# EAGLE design LispBadge (EAGLE 7.6.0)
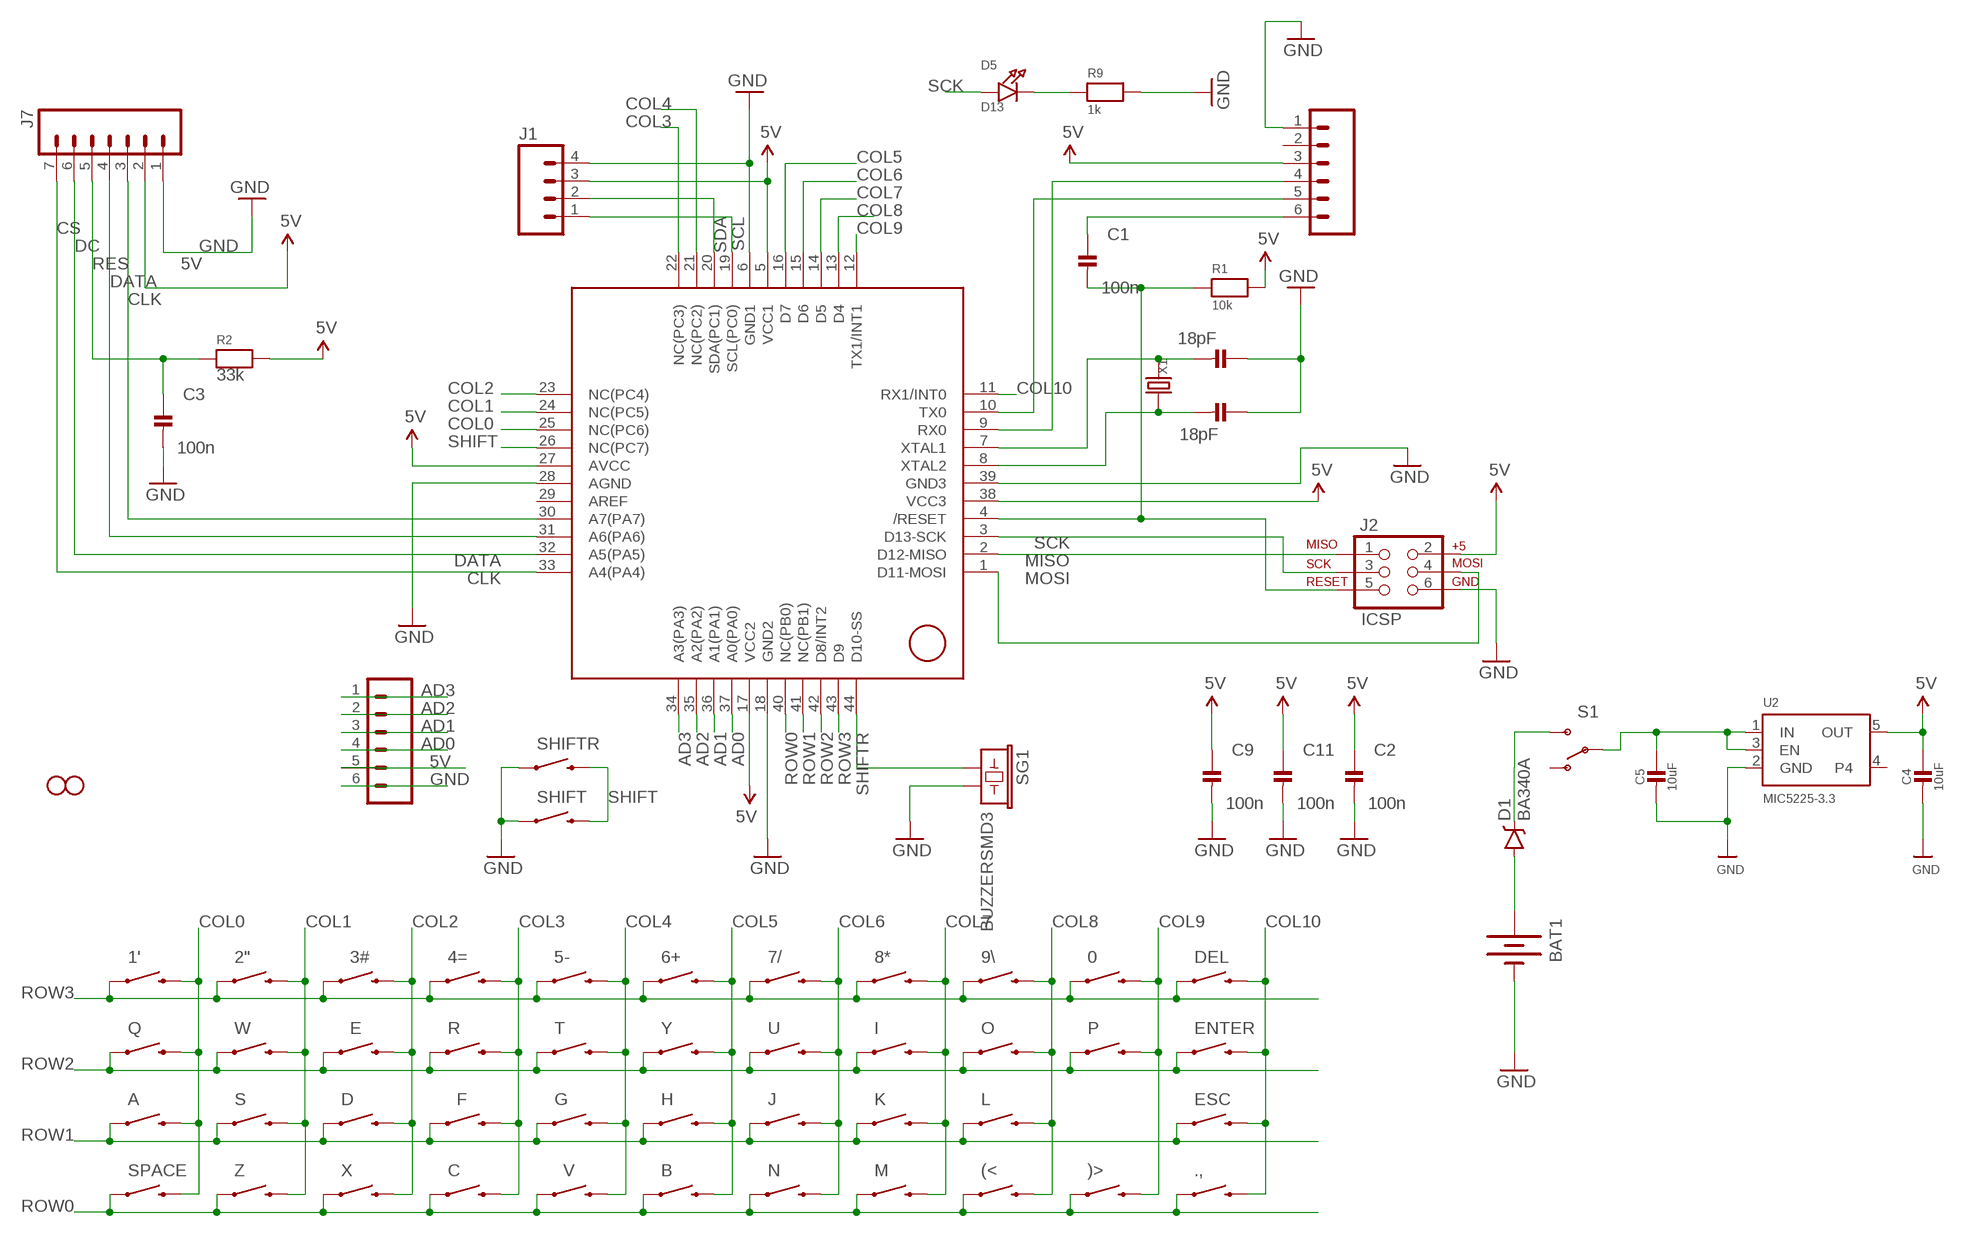
[diagram p0: schematic, sheet 1]

## Parts
0  SWITCH-MOMENTARY-2PTH  [TACTILE-PTH]
1'  SWITCH-MOMENTARY-2PTH  [TACTILE-PTH]
2"  SWITCH-MOMENTARY-2PTH  [TACTILE-PTH]
3#  SWITCH-MOMENTARY-2PTH  [TACTILE-PTH]
4=  SWITCH-MOMENTARY-2PTH  [TACTILE-PTH]
5-  SWITCH-MOMENTARY-2PTH  [TACTILE-PTH]
6+  SWITCH-MOMENTARY-2PTH  [TACTILE-PTH]
7/  SWITCH-MOMENTARY-2PTH  [TACTILE-PTH]
8*  SWITCH-MOMENTARY-2PTH  [TACTILE-PTH]
9\\  SWITCH-MOMENTARY-2PTH  [TACTILE-PTH]
(<  SWITCH-MOMENTARY-2PTH  [TACTILE-PTH]
)>  SWITCH-MOMENTARY-2PTH  [TACTILE-PTH]
.,  SWITCH-MOMENTARY-2PTH  [TACTILE-PTH]
A  SWITCH-MOMENTARY-2PTH  [TACTILE-PTH]
B  SWITCH-MOMENTARY-2PTH  [TACTILE-PTH]
BAT1  BATTERYAAA-KIT  [BATTERY-AAA-KIT]
C  SWITCH-MOMENTARY-2PTH  [TACTILE-PTH]
C1  100n  CAP_CERAMIC_0805MP  [_0805MP]
C2  100n  CAP_CERAMIC_0805MP  [_0805MP]
C3  100n  CAP_CERAMIC_0805MP  [_0805MP]
C4  10uF  CAP_CERAMIC0805-NOOUTLINE  [0805-NO]
C5  10uF  CAP_CERAMIC0805-NOOUTLINE  [0805-NO]
C9  100n  CAP_CERAMIC_0805MP  [_0805MP]
C11  100n  CAP_CERAMIC_0805MP  [_0805MP]
C12  18pF  CAP_CERAMIC_0805MP  [_0805MP]
C13  18pF  CAP_CERAMIC_0805MP  [_0805MP]
D  SWITCH-MOMENTARY-2PTH  [TACTILE-PTH]
D1  BA340A  B340A  [SMA-DIODE]
D5  D13  LED0805_NOOUTLINE  [CHIPLED_0805_NOOUTLINE]
DEL  SWITCH-MOMENTARY-2PTH  [TACTILE-PTH]
E  SWITCH-MOMENTARY-2PTH  [TACTILE-PTH]
ENTER  SWITCH-MOMENTARY-2PTH  [TACTILE-PTH]
ESC  SWITCH-MOMENTARY-2PTH  [TACTILE-PTH]
F  SWITCH-MOMENTARY-2PTH  [TACTILE-PTH]
G  SWITCH-MOMENTARY-2PTH  [TACTILE-PTH]
H  SWITCH-MOMENTARY-2PTH  [TACTILE-PTH]
I  SWITCH-MOMENTARY-2PTH  [TACTILE-PTH]
J  SWITCH-MOMENTARY-2PTH  [TACTILE-PTH]
J1  M04LONGPADS  [1X04_LONGPADS]
J2  ICSP  AVR_SPI_PRG_6PTH  [2X3]
J7  M07  [1X07]
JP1  M06LONGPADS  [1X06_LONGPADS]
JP4  STAND-OFF  [STAND-OFF]
JP5  STAND-OFF  [STAND-OFF]
JP11  M06LONGPADS  [1X06_LONGPADS]
K  SWITCH-MOMENTARY-2PTH  [TACTILE-PTH]
L  SWITCH-MOMENTARY-2PTH  [TACTILE-PTH]
M  SWITCH-MOMENTARY-2PTH  [TACTILE-PTH]
N  SWITCH-MOMENTARY-2PTH  [TACTILE-PTH]
O  SWITCH-MOMENTARY-2PTH  [TACTILE-PTH]
P  SWITCH-MOMENTARY-2PTH  [TACTILE-PTH]
Q  SWITCH-MOMENTARY-2PTH  [TACTILE-PTH]
R  SWITCH-MOMENTARY-2PTH  [TACTILE-PTH]
R1  10k  RESISTOR_0805MP  [_0805MP]
R2  33k  RESISTOR_0805MP  [_0805MP]
R9  1k  RESISTOR_0805MP  [_0805MP]
S  SWITCH-MOMENTARY-2PTH  [TACTILE-PTH]
S1  SWITCH-SPDTPTH  [SWITCH-SPDT]
SG1  BUZZERSMD3  [BUZZER-CMT1102]
SHIFT  SWITCH-MOMENTARY-2PTH  [TACTILE-PTH]
SHIFTR  SWITCH-MOMENTARY-2PTH  [TACTILE-PTH]
SPACE  SWITCH-MOMENTARY-2PTH  [TACTILE-PTH]
T  SWITCH-MOMENTARY-2PTH  [TACTILE-PTH]
U  SWITCH-MOMENTARY-2PTH  [TACTILE-PTH]
U2  MIC5225-3.3  VREG_SOT23-5  [SOT23-5]
U3  ATMEGA1284P  [TQFP44]
V  SWITCH-MOMENTARY-2PTH  [TACTILE-PTH]
W  SWITCH-MOMENTARY-2PTH  [TACTILE-PTH]
X  SWITCH-MOMENTARY-2PTH  [TACTILE-PTH]
X1  CRYSTAL-0500290P1  [2P-SMD-5.0X3.2]
Y  SWITCH-MOMENTARY-2PTH  [TACTILE-PTH]
Z  SWITCH-MOMENTARY-2PTH  [TACTILE-PTH]

## Nets
5V: C2.1 C4.1 C9.1 C11.1 J1.3 J2.2 J7.2 JP1.3 JP11.5 R1.2 R2.2 U2.5(OUT) U3.5(VCC1) U3.17(VCC2) U3.27(AVCC) U3.38(VCC3)
AD0: JP11.4 U3.37(A0(PA0))
AD1: JP11.3 U3.36(A1(PA1))
AD2: JP11.2 U3.35(A2(PA2))
AD3: JP11.1 U3.34(A3(PA3))
CLK: J7.3 U3.30(A7(PA7))
COL0: 1'.3 A.3 Q.3 SPACE.3 U3.25(NC(PC6))
COL1: 2".3 S.3 U3.24(NC(PC5)) W.3 Z.3
COL2: 3#.3 D.3 E.3 U3.23(NC(PC4)) X.3
COL3: 4=.3 C.3 F.3 R.3 U3.22(NC(PC3))
COL4: 5-.3 G.3 T.3 U3.21(NC(PC2)) V.3
COL5: 6+.3 B.3 H.3 U3.16(D7) Y.3
COL6: 7/.3 J.3 N.3 U3.15(D6) U.3
COL7: 8*.3 I.3 K.3 M.3 U3.14(D5)
COL8: 9\\.3 (<.3 L.3 O.3 U3.13(D4)
COL9: 0.3 )>.3 P.3 U3.12(TX1/INT1)
COL10: .,.3 DEL.3 ENTER.3 ESC.3 U3.11(RX1/INT0)
CS: J7.7 U3.33(A4(PA4))
DATA: J7.4 U3.31(A6(PA6))
DC: J7.6 U3.32(A5(PA5))
GND: BAT1.GND@1(-) C2.2 C3.2 C4.2 C5.2 C9.2 C11.2 C12.1 C13.1 J1.4 J2.6 J7.1 JP1.1 JP11.6 R9.2 SG1.2 SHIFT.1 SHIFTR.1 U2.2(GND) U3.6(GND1) U3.18(GND2) U3.28(AGND) U3.39(GND3)
MISO: J2.1 U3.2(D12-MISO)
MOSI: J2.4 U3.1(D11-MOSI)
N$1: BAT1.PWR@1(+) D1.A
N$2: D1.C S1.3(S)
N$3: D5.C R9.1
N$4: C5.1 S1.2(P) U2.1(IN) U2.3(EN)
N$8: C13.2 U3.8(XTAL2) X1.2
N$32: C12.2 U3.7(XTAL1) X1.1
N$34: C1.2 J2.5 R1.1 U3.4(/RESET)
N$35: C1.1 JP1.6
RES: C3.1 J7.5 R2.1
ROW0: (<.1 )>.1 .,.1 B.1 C.1 M.1 N.1 SPACE.1 U3.40(NC(PB0)) V.1 X.1 Z.1
ROW1: A.1 D.1 ESC.1 F.1 G.1 H.1 J.1 K.1 L.1 S.1 U3.41(NC(PB1))
ROW2: E.1 ENTER.1 I.1 O.1 P.1 Q.1 R.1 T.1 U3.42(D8/INT2) U.1 W.1 Y.1
ROW3: 0.1 1'.1 2".1 3#.1 4=.1 5-.1 6+.1 7/.1 8*.1 9\\.1 DEL.1 U3.43(D9)
RX-I: JP1.4 U3.9(RX0)
SCK: D5.A J2.3 U3.3(D13-SCK)
SCL: J1.1 U3.19(SCL(PC0))
SDA: J1.2 U3.20(SDA(PC1))
SHIFT: SHIFT.3 SHIFTR.3 U3.26(NC(PC7))
SHIFTR: SG1.1 U3.44(D10-SS)
TX-O: JP1.5 U3.10(TX0)
Unconnected: JP1.2 S1.1(O) U2.4 U3.29(AREF)

## Library data of the parts
0 1' 2" 3# 4= 5- 6+ 7/ 8* 9\\ (< )> ., A B C D DEL E ENTER ESC F G H I J K L M N O P Q R S SHIFT SHIFTR SPACE T U V W X Y Z = SparkFun-Electromechanical:SWITCH-MOMENTARY-2: Various NO switches- pushbuttons, reed, etc; PROD_ID: SWCH-08441
BAT1 = SparkFun-Electromechanical:BATTERY: Battery Holders Various common sizes : AA, AAA, 18650 (PRT-12895), 20mm coin cell and 12mm coin cell. 20MM_4LEGS, BATT-10373; PROD_ID: BATT-08571
C1-C5 C9 C11-C13 = microbuilder:CAP_CERAMIC: Ceramic Capacitors For new designs, use the packages preceded by an '_' character since they are more reliable: The following footprints should be used on most boards: _0402 - Standard footprint for regular board layouts _0603 - Standard footprint for regular board layouts _0805 - Standard footprint for regular board layouts _1206 - Standard footprint for regular board layouts For extremely tight-pitch boards where space is at a premium, the following 'micro-pitch' footprints can be used (smaller pads, no silkscreen outline, etc.): _0402MP - Micro-pitch footprint for very dense/compact boards _0603MP - Micro-pitch footprint for very dense/compact boards _0805MP - Micro-pitch footprint for very dense/compact boards _1206MP - Micro-pitch footprint for very dense/compact boards
D1 = SparkFun-DiscreteSemi:B340A: Schottky Diode 3A-40V; PROD_ID: DIO-09886
D5 = microbuilder:LED: LED 0603 - 0603 Surface Mount Package 2mA: Green LED - Low Power (3.9mcd, 2ma, 1.7Vf) - Digikey: 475-2709-2-ND Orange LED - Low Power (9.8mcd, 2ma, 1.8Vf) - Digikey: 475-1194-2-ND Red LED - Low Power (5mcd, 2ma, 1.8Vf) - Digikey: 475-1195-2-ND Yellow LED - Low Power (7mcd, 2ma, 1.8Vf) - Digikey: 475-1196-2-ND 5mA: Blue LED - Low Power (17mcd, 5ma, 2.9Vf) - Digikey: LNJ937W8CRACT-ND 0805 - 0805 Surface Mount Package 2mA: Red LED (8.8mcd, 2mA, 1.8Vf, Clear) - Low Power [Digikey: 475-2510-1-ND] Green LED (5mcd, 2mA, 1.8Vf, Clear) - Low Power [Digikey: 475-2730-1-ND] Yellow LED (11.3mcd, 2mA, 1.8Vf, Clear) - Low Power [Digikey: 475-2555-1-ND] 20mA: Red LED (104mcd, 20mA, Diffused) - LS R976 [Digikey: 475-1278-6-ND] Red LED (12mcd, 20mA, 2.0Vf, Clear) - APT2012EC [Digikey: 754-1128-1-ND] Green LED (15mcd, 20mA, 2.2Vf, Clear) - APT2012GC [Digikey: 754-1131-1-ND] Orange LED (160mcd, 20mA, 2.1Vf, Clear) - APT2012SECK [Digikey: 754-1130-1-ND] 1206 - 1206 Surface Mount Package Green LED (26mcd, 20mA, Diffused) - LG N971 [Digikey: 475-1407-6-ND] Red LED (15mcd, 20mA, Diffused) - LH N974 [Digikey: 475-1416-6-ND]
J1 = SparkFun-Connectors:M04: Header 4 Standard 4-pin 0.1" header. Use with straight break away headers (SKU : PRT-00116), right angle break away headers (PRT-00553), swiss pins (PRT-00743), machine pins (PRT-00117), and female headers (PRT-00115). Molex polarized connector foot print use with SKU : PRT-08231 with associated crimp pins and housings. 1MM SMD Version SKU: PRT-10208; PROD_ID: CONN-09696
J2 = SparkFun:AVR_SPI_PRG_6: AVR ISP 6 Pin This is the reduced ISP connector for AVR programming. Common on Arduino. This footprint will take up less PCB space and can be used with a 10-pin to 6-pin adapter such as SKU: BOB-08508
J7 = SparkFun-Connectors:M07: Header 7 Standard 7-pin 0.1" header. Use with straight break away headers (SKU : PRT-00116), right angle break away headers (PRT-00553), swiss pins (PRT-00743), machine pins (PRT-00117), and female headers (PRT-00115). NOTES ON THE VARIANTS LOCK and LOCK_LONGPADS... This footprint was designed to help hold the alignment of a through-hole component (i.e. 7-pin header) while soldering it into place. You may notice that each hole has been shifted either up or down by 0.005 of an inch from it's more standard position (which is usually a perfectly straight line). This slight alteration caused the pins (the squares in the middle) to touch the edges of the holes. Because they are alternating, it causes a "brace" to hold the header in place. 0.005 has proven to be the perfect amount of "off-center" position when using our standard breakaway headers. Although looks a little odd when you look at the bare footprint, once you have a header in there, the alteration is very hard to notice. Also, if you push a header all the way into place, it is covered up entirely on the bottom side. This idea of altering the position of holes to aid alignment will be further integrated into the Sparkfun Library for other footprints. It can help hold any component with 3 or more connection pins.
JP1 JP11 = SparkFun-Connectors:M06: Header 6 Standard 6-pin 0.1" header. Use with straight break away headers (SKU : PRT-00116), right angle break away headers (PRT-00553), swiss pins (PRT-00743), machine pins (PRT-00117), and female headers (PRT-00115). Molex polarized connector foot print use with SKU : PRT-08094 with associated crimp pins and housings. NOTES ON THE VARIANTS LOCK and LOCK_LONGPADS... This footprint was designed to help hold the alignment of a through-hole component (i.e. 6-pin header) while soldering it into place. You may notice that each hole has been shifted either up or down by 0.005 of an inch from it's more standard position (which is a perfectly straight line). This slight alteration caused the pins (the squares in the middle) to touch the edges of the holes. Because they are alternating, it causes a "brace" to hold the component in place. 0.005 has proven to be the perfect amount of "off-center" position when using our standard breakaway headers. Although looks a little odd when you look at the bare footprint, once you have a header in there, the alteration is very hard to notice. Also,if you push a header all the way into place, it is covered up entirely on the bottom side. This idea of altering the position of holes to aid alignment will be further integrated into the Sparkfun Library for other footprints. It can help hold any component with 3 or more connection pins.
JP4 JP5 = SparkFun:STAND-OFF: Stand Off This is the mechanical footprint for a #4 phillips button head screw. Use the keepout ring to avoid running the screw head into surrounding components. SKU : PRT-00447
R1 R2 R9 = microbuilder:RESISTOR: Resistors 0402 - 0402 Surface Mount Package 22 Ohm 1% 1/16W [Digikey: 311-22.0LRTR-ND] 33 Ohm 5% 1/16W 1.0K 5% 1/16W 1.5K 5% 1/16W 2.0K 1% 1/16W 10.0K 1% 1/16W [Digikey: 311-10.0KLRTR-ND] 10.0K 5% 1/16W [Digikey: RMCF0402JT10K0TR-ND] 12.1K 1% 1/16W [Digikey: 311-22.0LRTR-ND] 100.0K 5% 1/16W 0603 - 0603 Surface Mount Package 0 Ohm 1/10 Watt 1% Resistor 15 Ohm 1/10 Watt 1% Resistor 33 Ohm 1/10 Watt 1% Resistor 49.9 Ohm 1/10 Watt 1% Resistor 100 Ohm 1/10 Watt 1% Resistor 150 Ohm 1/10 Watt 1% Resistor 240 Ohm 1/10 Watt 1% Resistor 390 Ohm 1/10 Watt 1% Resistor 560 Ohm 1/10 Watt 1% Resistor 680 Ohm 1/10 Watt 1% Resistor 750 Ohm 1/10 Watt 1% Resistor 1.0K Ohm 1/10 Watt 1% Resistor 1.5K Ohm 1/10 Watt 1% Resistor 2.0K Ohm 1/10 Watt 1% Resistor 2.2K Ohm 1/10 Watt 1% Resistor 3.3K Ohm 1/10 Watt 1% Resistor 4.7K Ohm 1/10 Watt 1% Resistor 10.0K Ohm 1/10 Watt 1% Resistor 12.0K Ohm 1/10 Watt 1% Resistor 12.1K Ohm 1/10 Watt 1% Resistor 20.0K Ohm 1/10 Watt 1% Resistor 33.0K Ohm 1/10 Watt 1% Resistor 100.0K Ohm 1/10 Watt 1% Resistor 0805 - 0805 Surface Mount Package 0 Ohm 1/8 Watt 1% Resistor 33 Ohm 1/8 Watt 1% Resistor 100 Ohm 1/8 Watt 1% Resistor 150 Ohm 1/8 Watt 1% Resistor 200 Ohm 1/8 Watt 1% Resistor 240 Ohm 1/8 Watt 1% Resistor 330 Ohm 1/8 Watt 1% Resistor 390 Ohm 1/8 Watt 1% Resistor 470 Ohm 1/8 Watt 1% Resistor 1.0K Ohm 1/8 Watt 1% Resistor 1.5K Ohm 1/8 Watt 1% Resistor 2.0K Ohm 1/8 Watt 1% Resistor 4.7K Ohm 1/8 Watt 1% Resistor 5.1K Ohm 1/8 Watt 1% Resistor 5.6K Ohm 1/8 Watt 1% Resistor 10.0K Ohm 1/8 Watt 1% Resistor 22.0K Ohm 1/8 Watt 1% Resistor 33.0K Ohm 1/8 Watt 1% Resistor 100K Ohm 1/8 Watt 1% Resistor 1206 - 1206 Surface Mount Package 2012 - 2010 Surface Mount Package 0.11 Ohm 1/2 Watt 1% Resistor - Digikey: RHM.11UCT-ND
S1 = SparkFun-Electromechanical:SWITCH-SPDT: SPDT Switch Simple slide switch, Spark Fun Electronics SKU : COM-00102 DPDT SMT slide switch, AYZ0202, SWCH-08179; PROD_ID: SWCH-08261
SG1 = SparkFun-Electromechanical:BUZZER: Buzzer 12mm Spark Fun Electronics SKU : Comp-Buzzer
U2 = microbuilder:VREG_SOT23-5: SOT23-5 Fixed Voltage Regulators Part Current Out V Out V In V Dropout θJA (°C/W) TJ (°C) Digikey Part No. ADP121 150mA 3.3V 3.4-5.5V 0.09V @ 150mA -- -- ADP121-AUJZ33R7CT-ND ADP121 150mA 3.0V 3.1-5.5V 0.09V @ 150mA -- -- ADP121-AUJZ30R7CT-ND ADP122 300mA 3.3V 3.4-5.5V 0.085V @ 300mA -- -- ADP122AUJZ-3.3-R7CT-ND ADP1712 300mA 3.3V 3.5-5.5V 0.17V @ 300mA -- -- ADP1712AUJZ-3.3-R7TR-ND AP7311 (Low Cost) 150mA 3.3V 3.5-6V 0.15V @ 150mA -- -- AP7311-33WG-7DICT-ND LD39015M18R 150mA 1.8V 1.9V-5.5V 0.08V @ 100mA -- -- 497-6977-1-ND LP2985A-33DBVR 150mA 3.3V 3.3-16V 0.28V @ 150mA 206 150 296-18479-1-ND MCP1824T-3302E/OT 300mA 3.3V 3.5V-6V 0.2V @ 300mA -- -- MCP1824T-3302E/OTCT-ND MIC5205-2.5YM5 TR 150mA 2.5V 2.7-16V 0.165V @ 150mA -- -- 576-1257-2-ND MIC5205-3.0YM5 TR 150mA 3.0V 3.2V-16V 0.165V @ 150mA -- -- 576-1258-2-ND MIC5205-3.3YM5 TR 150mA 3.3V 3.5V-16V 0.165V @ 150mA -- -- 576-1259-2-ND TPS780330220 150mA 3.3V+2.2V 3.6-5.5V 250mV Max -- -- 296-23332-1-ND TDA3663/N1,135 100mA 3.3V 3.5-45V 0.18V @ 50mA -- -- 568-5343-1-ND Max operating temp can be calculated using θJA, TJ (max junction temperature), and power in watts. Set the "Maximum Ambient Temperature" until it reaches TJ ("Max Junction Temperature"), which is the absolute limit for safe use of the regulator: Heat Sink Temperature Calculator <http://www.daycounter.com/Calculators/Heat-Sink-Temperature-Calculator.phtml> For example, With 12V source into a 3.3V LP2985 and a 30mA load, we are dissipating (12V-3.3V) * 0.03A = 0.261W. With a θJA of 206 °C/W, a TJ of 150°C, and 261mW we can safely use the chip without a heat sink up to 75°C (=147.1°C Junction Temperature).
U3 = K-Duino:ATMEGA1284P
X1 = OPL Eagle Library:CRYSTAL*

## Net classes
0 default: width 0.152 mm, drill 0.305 mm, clearance 0.152 mm

## Board
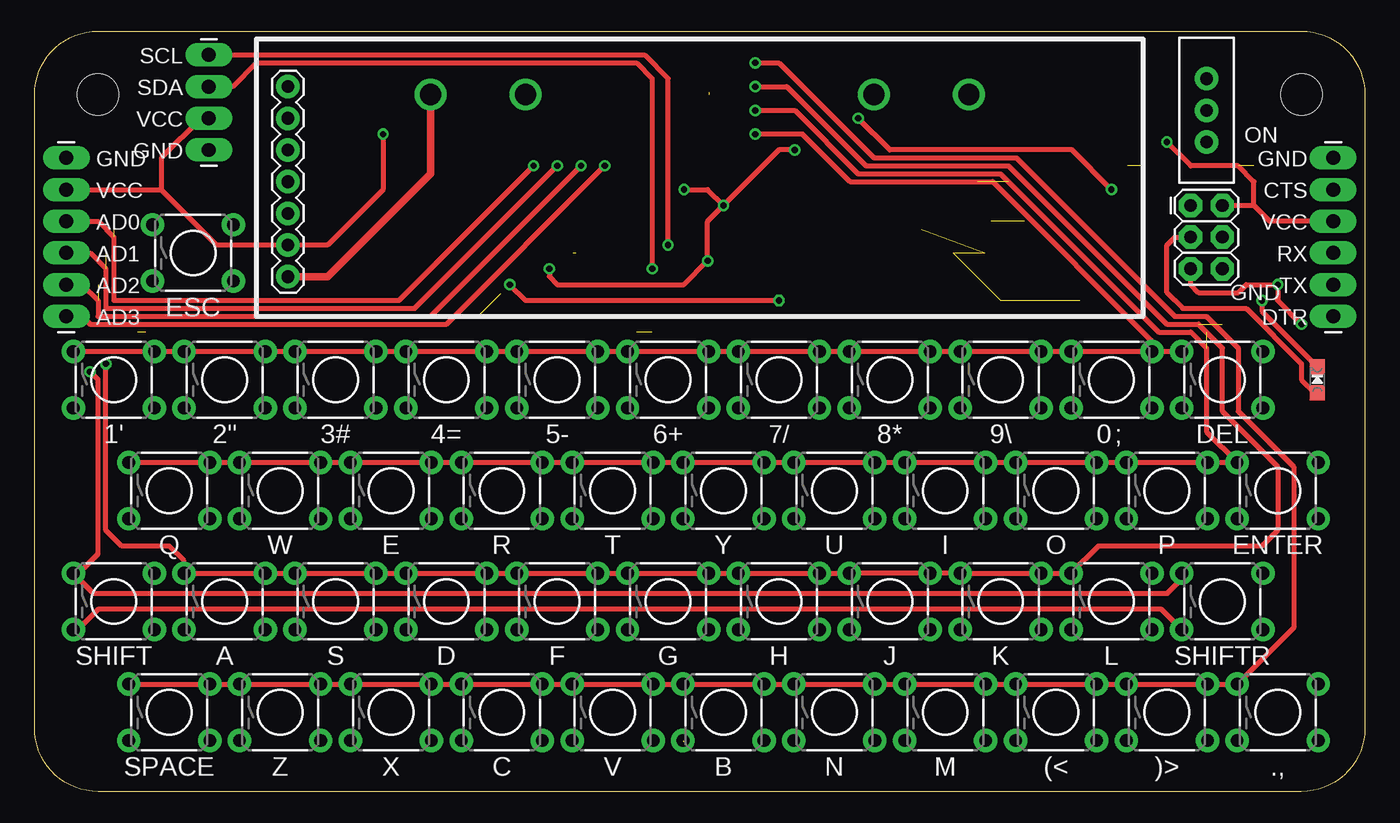
[diagram p1: board, top side]
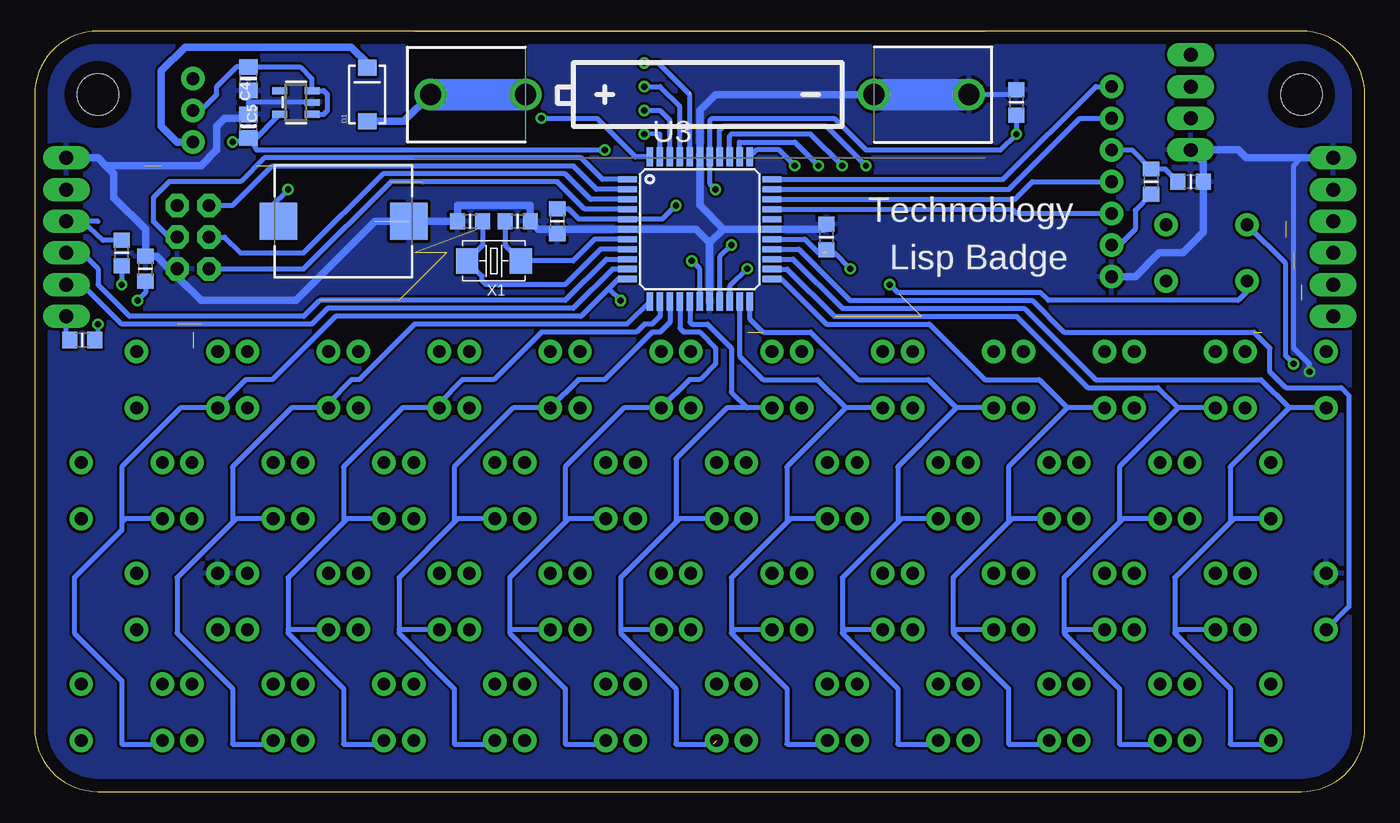
[diagram p2: board, bottom side, seen from below]

Size 106.68 x 60.96 mm. Coordinates in mm from the lower left corner, seen from the top.
Outline: 0,5.08 0,55.88 arc-90 5.08,60.96 101.6,60.96 arc-90 106.68,55.88 106.68,5.08 arc-90 101.6,0 5.08,0 arc-90 0,5.08
Copper layers (1*16): Top 0.035mm / dielectric 1.5mm / Bottom 0.035mm
Design rules "default *": minimum track width 10mil, minimum drill 24mil, track to track 8mil, track to pad 8mil, pad to pad 8mil, via to via 8mil, smd to smd 8mil, copper to edge 40mil, drill to drill 8mil, minimum pad ring 10mil, minimum via ring 8mil, stop-mask expansion 4mil, vias tented up to drill 20mil, thermal gap 10mil

### Footprints (pad centres in the part's own frame; a part is rotated, then mirrored left to right if it is on the bottom)
TACTILE-PTH = drill 1.016 pad 1.88: 1 -3.251,2.261; 2 3.251,2.261; 3 -3.251,-2.261; 4 3.251,-2.261
BATTERY-AAA-KIT = drill 1.702: GND@1 21.59,0; GND@2 13.97,0; PWR@1 -21.59,0; PWR@2 -13.97,0
_0805MP = smd 1.2 x 1.3: 1 -1.016,0; 2 1.016,0
0805-NO = smd 1.24 x 1.5: 1 -0.95,0; 2 0.95,0
SMA-DIODE = smd 1.27 x 1.47: A -2.15,0; C 2.15,0
CHIPLED_0805_NOOUTLINE = smd 1.2 x 1.2: A 0,-1.05; C 0,1.05
1X04_LONGPADS = drill 1.118 pad 1.88 long: 1 0,0; 2 2.54,0; 3 5.08,0; 4 7.62,0
2X3 = drill 1.016 pad 1.88 octagon: 1 0,0; 2 0,2.54; 3 2.54,0; 4 2.54,2.54; 5 5.08,0; 6 5.08,2.54
1X07 = drill 1.016 pad 1.88: 1 0,0; 2 2.54,0; 3 5.08,0; 4 7.62,0; 5 10.16,0; 6 12.7,0; 7 15.24,0
1X06_LONGPADS = drill 1.118 pad 1.88 long: 1 0,0; 2 2.54,0; 3 5.08,0; 4 7.62,0; 5 10.16,0; 6 12.7,0
STAND-OFF = hole 3.302: 0,0
SWITCH-SPDT = drill 1.016 pad 1.88: 1 0,2.54; 2 0,0; 3 0,-2.54
BUZZER-CMT1102 = smd 3 x 3: 1 -5.23,0; 2 5.23,0
SOT23-5 = smd 0.55 x 1.2: 1 -0.95,-1.3; 2 0,-1.3; 3 0.95,-1.3; 4 0.95,1.3; 5 -0.95,1.3
TQFP44 = smd 1.5 x 0.5: 1 -5.8,4; 2 -5.8,3.2; 3 -5.8,2.4; 4 -5.8,1.6; 5 -5.8,0.8; 6 -5.8,0; 7 -5.8,-0.8; 8 -5.8,-1.6; 9 -5.8,-2.4; 10 -5.8,-3.2; 11 -5.8,-4; 23 5.8,-4; 24 5.8,-3.2; 25 5.8,-2.4; 26 5.8,-1.6; 27 5.8,-0.8; 28 5.8,0; 29 5.8,0.8; 30 5.8,1.6; 31 5.8,2.4; 32 5.8,3.2; 33 5.8,4 | smd 0.5 x 1.5: 12 -4,-5.8; 13 -3.2,-5.8; 14 -2.4,-5.8; 15 -1.6,-5.8; 16 -0.8,-5.8; 17 0,-5.8; 18 0.8,-5.8; 19 1.6,-5.8; 20 2.4,-5.8; 21 3.2,-5.8; 22 4,-5.8; 34 4,5.8; 35 3.2,5.8; 36 2.4,5.8; 37 1.6,5.8; 38 0.8,5.8; 39 0,5.8; 40 -0.8,5.8; 41 -1.6,5.8; 42 -2.4,5.8; 43 -3.2,5.8; 44 -4,5.8
2P-SMD-5.0X3.2 = smd 1.778 x 2.032: 1 -2.159,0; 2 2.159,0

### Placement (x,y rotation side)
0  86.36,33.02 0 top
1'  6.35,33.02 0 top
2"  15.24,33.02 0 top
3#  24.13,33.02 0 top
4=  33.02,33.02 0 top
5-  41.91,33.02 0 top
6+  50.8,33.02 0 top
7/  59.69,33.02 0 top
8*  68.58,33.02 0 top
9\\  77.47,33.02 0 top
(<  81.91,6.35 0 top
)>  90.8,6.35 0 top
.,  99.69,6.35 0 top
A  15.24,15.24 0 top
B  55.25,6.35 0 top
BAT1  53.34,55.88 0 bottom
C  37.47,6.35 0 top
C1  102.87,36.2 0 bottom
C2  64.77,45.72 270 bottom
C3  13.97,48.9 0 bottom
C4  89.53,53.34 90 bottom
C5  89.53,57.15 270 bottom
C9  43.18,44.45 90 bottom
C11  27.94,55.25 90 bottom
C12  67.94,45.72 180 bottom
C13  71.75,45.72 0 bottom
D  33.02,15.24 0 top
D1  80.01,55.88 90 bottom
D5  102.87,33.02 0 top
DEL  95.25,33.02 0 top
E  28.57,24.13 0 top
ENTER  99.69,24.13 0 top
ESC  12.7,43.18 0 top
F  41.91,15.24 0 top
G  50.8,15.24 0 top
H  59.69,15.24 0 top
I  73.02,24.13 0 top
J  68.58,15.24 0 top
J1  13.97,59.05 270 top
J2  92.71,46.99 270 top
J7  20.32,41.28 90 top
JP1  104.14,50.8 270 top
JP4  5.08,55.88 0 top
JP5  101.6,55.88 0 top
JP11  2.54,38.1 90 top
K  77.47,15.24 0 top
L  86.36,15.24 0 top
M  73.02,6.35 0 top
N  64.14,6.35 0 top
O  81.91,24.13 0 top
P  90.8,24.13 0 top
Q  10.79,24.13 0 top
R  37.47,24.13 0 top
R1  99.69,43.18 90 bottom
R2  17.14,48.9 270 bottom
R9  97.79,41.91 90 bottom
S  24.13,15.24 0 top
S1  93.98,54.61 0 top
SG1  81.91,45.72 0 bottom
SHIFT  6.35,15.24 0 top
SHIFTR  95.25,15.24 0 top
SPACE  10.79,6.35 0 top
T  46.36,24.13 0 top
U  64.14,24.13 0 top
U2  85.72,55.25 90 bottom
U3  53.34,45.09 0 bottom
V  46.36,6.35 0 top
W  19.68,24.13 0 top
X  28.57,6.35 0 top
X1  69.85,42.55 180 bottom
Y  55.25,24.13 0 top
Z  19.68,6.35 0 top

### Tracks (layer width: path | path; a pad name or v marks a point on that pad's centre or on a via)
5V  (via drill 0.5)  (2 unrouted)
  Top 0.406: v55.25,46.99 53.98,45.72 v53.98,42.55 52.07,40.64 41.91,40.64 41.28,41.28 v41.28,41.91 | v52.07,48.26 53.98,48.26 v55.25,46.99 | JP11.5 10.16,48.26 | J1.3 13.33,53.98 10.16,50.8 10.16,48.26 | v27.94,52.71 27.94,48.26 23.5,43.82 J7.2 14.61,43.82 10.16,48.26 | v90.8,52.07 92.71,50.17 96.52,50.17 97.79,48.9 97.79,46.99 | 102.87,45.72 99.06,45.72 97.79,46.99 | J2.2 97.79,46.99 | v60.96,51.44 59.69,51.44 v55.25,46.99
  Top 0.61: JP1.3 102.87,45.72
  Bottom 0.406: U3.17 53.34,41.91 v53.98,42.55 | v55.25,46.99 56.35,45.89 U3.5 63.03,45.89 63.88,46.74 C2.1 | v52.07,48.26 52.54,48.73 U3.38 52.54,53.81 52.38,53.98 42.55,53.98 40.01,51.44 29.21,51.44 v27.94,52.71 C11.1 27.94,54.61 | 101.6,45.72 102.87,45.72 | 102.87,45.72 JP1.3 | 43.18,43.18 42.55,43.18 v41.28,41.91 | v60.96,51.44 88.9,51.44 89.21,52.07 | U3.27 44.92,44.29 43.82,43.18 43.43,43.18 C9.1 | v90.8,52.07 C4.1 89.21,52.07 | 89.21,52.07 89.21,52.11 U2.5 | R2.2 18.41,46.61 18.41,45.09 19.68,43.82 J7.2 | R1.2 101.22,44.2 102.87,45.72
AD0  (via drill 0.5)  (1 unrouted)
  Top 0.406: v40.01,50.17 29.21,39.37 6.35,39.37 6.35,44.45 5.08,45.72 JP11.4
  Bottom 0.406: v40.01,50.17 43.18,53.34 51.44,53.34 51.74,53.04 U3.37
AD1  (via drill 0.5)  (1 unrouted)
  Top 0.406: v41.91,50.17 30.48,38.74 5.71,38.74 5.71,41.91 4.45,43.18 JP11.3
  Bottom 0.406: v41.91,50.17 44.45,52.71 50.8,52.71 50.94,52.57 U3.36
AD2  (via drill 0.5)  (1 unrouted)
  Top 0.406: v43.82,50.17 31.75,38.1 5.08,38.1 5.08,39.37 3.81,40.64 JP11.2
  Bottom 0.406: v43.82,50.17 45.72,52.07 50.17,52.07 50.14,51.46 U3.35
AD3  (via drill 0.5)
  Top 0.406: v45.72,50.17 33.02,37.47 4.45,37.47 3.81,38.1 JP11.1
  Bottom 0.406: 49.26,50.8 U3.34 48.79,51.44 46.99,51.44 v45.72,50.17
CLK
  Bottom 0.406: U3.30 28.27,46.69 27.94,46.36 J7.3
COL0
  Bottom 0.406: 1'.3 6.07,30.76 | 6.07,30.76 10.79,26.04 10.79,21.59 | 10.79,21.59 15.24,17.14 15.24,12.7 | 15.24,12.7 10.79,8.26 10.79,3.81 7.82,3.81 SPACE.3 | A.3 14.96,12.98 15.24,12.7 | Q.3 10.52,21.87 10.79,21.59 | 6.07,30.76 8.33,33.02 21.59,33.02 27.3,38.74 41.91,38.74 45.86,42.69 U3.25
COL1  (2 unrouted)
  Bottom 0.406: 2".3 14.96,30.76 | 14.96,30.76 19.68,26.04 19.68,21.59 | 19.68,21.59 24.13,17.14 24.13,12.7 | 24.13,12.7 19.68,8.26 19.68,3.81 16.71,3.81 Z.3 | S.3 23.85,12.98 24.13,12.7 | W.3 19.41,21.87 19.68,21.59 | 14.96,30.76 16.59,32.38 22.22,32.38 27.94,38.1 42.55,38.1 46.33,41.89 U3.24
COL2
  Bottom 0.406: 3#.3 23.85,30.76 | 23.85,30.76 28.57,26.04 28.57,21.59 | 28.57,21.59 33.02,17.14 33.02,12.7 | 33.02,12.7 28.57,8.26 28.57,3.81 25.6,3.81 X.3 | D.3 32.74,12.98 33.02,12.7 | E.3 28.3,21.87 28.57,21.59 | 23.85,30.76 26.11,33.02 30.48,33.02 34.93,37.47 43.18,37.47 46.8,41.09 U3.23
COL3  (1 unrouted)
  Bottom 0.406: 4=.3 32.74,30.76 | 32.74,30.76 37.47,26.04 37.47,21.59 | 37.47,21.59 41.91,17.14 41.91,12.7 | 41.91,12.7 37.47,8.26 37.47,3.81 34.49,3.81 C.3 | F.3 41.63,12.98 41.91,12.7 | R.3 37.19,21.87 37.47,21.59 | 32.74,30.76 35,33.02 40.64,33.02 44.45,36.83 48.26,36.83 49.34,37.91 U3.22
COL4
  Bottom 0.406: 5-.3 41.63,30.76 | 41.63,30.76 46.36,26.04 46.36,21.59 | 46.36,21.59 50.8,17.14 50.8,12.7 | 50.8,12.7 46.36,8.26 46.36,3.81 43.38,3.81 V.3 | G.3 50.52,12.98 50.8,12.7 | T.3 46.08,21.87 46.36,21.59 | 41.63,30.76 43.89,33.02 48.26,33.02 50.14,34.9 U3.21
COL5  (1 unrouted)
  Bottom 0.406: 6+.3 49.53,30.76 | 49.53,30.76 51.16,30.76 55.25,26.67 55.25,21.59 | 55.25,21.59 59.69,17.14 59.69,12.98 | 52.27,3.81 55.25,3.81 55.25,8.26 59.69,12.7 59.69,12.98 | Y.3 54.97,21.87 55.25,21.59 | H.3 59.69,12.98 | U3.16 54.14,37.63 53.98,37.47 52.71,37.47 50.8,35.56 50.8,32.03 49.53,30.76
COL6
  Bottom 0.406: 64.14,21.59 64.14,26.04 59.41,30.76 7/.3 54.18,33.02 53.34,33.02 52.07,34.29 52.07,35.56 53.34,36.83 54.61,36.83 54.94,37.16 U3.15 | 64.14,21.59 68.58,17.14 68.58,12.98 | N.3 61.16,3.81 64.14,3.81 64.14,8.26 68.58,12.7 68.58,12.98 | U.3 63.86,21.87 64.14,21.59 | J.3 68.58,12.98
COL7
  Bottom 0.406: 73.02,21.59 73.02,26.04 68.3,30.76 8*.3 63.07,33.02 60.96,33.02 57.15,36.83 56.52,36.83 55.74,37.61 U3.14 | 73.02,21.59 77.47,17.14 77.47,12.98 | M.3 70.05,3.81 73.02,3.81 73.02,8.26 77.47,12.7 77.47,12.98 | I.3 72.75,21.87 73.02,21.59 | K.3 77.47,12.98
COL8
  Bottom 0.406: 81.91,21.59 81.91,26.04 77.19,30.76 9\\.3 74.22,31.19 72.39,33.02 69.85,33.02 66.04,36.83 58.42,36.83 57.79,37.47 57.15,37.47 56.57,38.05 56.57,38.1 56.54,38.08 U3.13 | 81.91,21.59 86.36,17.14 86.36,12.98 | (<.3 78.94,3.81 81.91,3.81 81.91,8.26 86.36,12.7 86.36,12.98 | O.3 81.64,21.87 81.91,21.59 | L.3 86.36,12.98
COL9
  Bottom 0.406: 90.8,21.59 90.8,26.04 86.08,30.76 0.3 83.11,31.19 81.28,33.02 80.64,33.02 76.2,37.47 59.16,37.47 U3.12 | 90.8,21.59 95.25,17.14 95.25,12.7 90.8,8.26 90.8,3.81 87.83,3.81 )>.3 | P.3 90.53,21.87 90.8,21.59
COL10  (via drill 0.5)
  Top 0.406: v38.1,40.64 39.37,39.37 v59.69,39.37
  Bottom 0.406: 99.69,21.59 99.69,26.04 94.97,30.76 DEL.3 89.74,33.02 87.63,33.02 82.55,38.1 62.87,38.1 60.64,40.32 | 99.69,21.59 99.69,20.95 103.5,17.14 103.5,12.7 99.69,8.89 99.69,3.81 96.72,3.81 .,.3 | ENTER.3 99.42,21.87 99.69,21.59 | U3.11 59.88,41.09 60.64,40.32 | ESC.3 9.45,40.08 10.16,39.37 25.4,39.37 26.04,40.01 37.47,40.01 v38.1,40.64 | v59.69,39.37 60.64,40.32
CS
  Bottom 0.406: U3.33 29.02,49.09 21.59,56.52 J7.7
DATA
  Bottom 0.406: U3.31 28.08,47.49 26.67,48.9 J7.4
DC
  Bottom 0.406: U3.32 28.55,48.29 22.86,53.98 J7.6
GND  (via drill 0.5)  (1 unrouted)
  Top 0.406: SHIFTR.1 92,17.07 90.8,15.88 4.72,15.88 SHIFT.1 3.53,17.5 5.08,19.05 5.08,33.02 v4.45,33.66
  Top 0.61: J7.1 23.5,41.28 31.75,49.53 BAT1.GND@1
  Bottom 0.406: v4.45,33.66 4.45,34.29 5.71,35.56 5.71,50.17 5.08,50.8 | 67.09,45.51 C12.1 67.31,45.94 | C2.2 64.77,45.09 | 27.94,56.1 C11.2 28.32,55.88 BAT1.GND@1 | 43.4,45.09 43.4,45.25 C9.2 | U2.2 89.53,55.25 | 89.85,53.98 C4.2 89.53,55.25 | 89.53,55.25 C5.2 | J2.6 95.88,41.91
  Bottom 0.61: 51.44,45.09 U3.28 43.4,45.09 | 51.44,45.09 53.34,46.99 U3.39 53.34,54.61 52.07,55.88 39.37,55.88 | 51.44,45.09 52.54,43.98 | 52.54,43.98 U3.18 | 52.54,43.98 53.65,45.09 U3.6 64.77,45.09 66.29,45.09 C12.1 66.93,46.99 72.77,46.99 C13.1 79.38,45.72 85.72,39.37 93.34,39.37 95.25,41.28 J2.6 | 102.87,50.8 JP1.1 101.6,50.8 100.96,50.17 | J7.1 18.41,41.28 16.51,43.18 14.61,43.18 12.95,44.83 C3.2 12.95,50.42 J1.4 10.16,51.44 9.53,50.8 5.08,50.8 JP11.6 | 89.85,53.98 91.44,53.98 92.08,53.34 92.08,51.44 93.34,50.17 95.5,50.17 100.96,50.17 | 100.96,50.17 100.33,49.53 100.33,47.62 97.79,45.09 R9.2 96.9,42.93 95.88,41.91
  Bottom 2.54: BAT1.GND@1 39.37,55.88
  pour Bottom: 0,60.96 106.68,60.96 106.68,0 0,0
MISO  (1 unrouted)
  Bottom 0.406: U3.2 61.62,48.29 63.5,50.17 87.63,50.17 90.8,46.99 J2.1
MOSI
  Bottom 0.406: U3.1 61.15,49.09 62.87,50.8 88.27,50.8 90.17,48.9 95.88,48.9 97.16,47.62 97.16,45.72 95.88,44.45 J2.4
N$1
  Bottom 0.61: D1.A 77.08,53.73 BAT1.PWR@1
  Bottom 2.54: BAT1.PWR@1 67.31,55.88
N$2
  Bottom 0.406: D1.C 80.01,58.42
  Bottom 0.61: 80.01,58.42 81.28,59.69 94.61,59.69 96.52,57.79 96.52,53.34 95.25,52.07 S1.3
N$3  (via drill 0.5)
  Top 0.406: v98.42,39.37 98.42,38.52 D5.C
  Bottom 0.406: R9.1 97.79,40.01 v98.42,39.37
N$4
  Bottom 0.406: U2.1 83.5,54.3 83.19,54.61 83.19,55.88 83.5,56.2 U2.3 84.45,56.23 84.45,57.15 85.41,58.1 C5.1 90.49,58.1 92.08,56.52 92.08,55.88 93.34,54.61 S1.2
N$8
  Bottom 0.406: U3.8 61.29,43.49 64.14,40.64 70.48,40.64 70.79,40.95 70.79,41.33 X1.2 70.74,43.82 C13.2
N$32
  Bottom 0.406: X1.1 67.94,42.29 67.94,41.91 67.78,41.75 | U3.7 61.76,44.29 63.5,42.55 X1.1 | C12.2 68.96,43.82 X1.1
N$34  (via drill 0.5)  (1 unrouted)
  Top 0.406: v101.6,37.47 99.69,39.37 v99.69,40.64 97.16,40.64 96.52,40.01 93.34,40.01 92.71,40.64 J2.5
  Bottom 0.406: U3.4 62.56,46.69 64.77,48.9 78.1,48.9 85.09,41.91 J2.5 | 75.59,48.9 75.59,48.87 | C1.2 101.6,36.45 v101.6,37.47 | R1.1 v99.69,40.64
N$35
  Bottom 0.406: C1.1 104.14,36.45 JP1.6
RES
  Bottom 0.406: J7.5 18.67,51.44 R2.1 16,49.91 C3.1
ROW0  (via drill 0.5)  (1 unrouted)
  Top 0.406: SPACE.1 Z.1 X.1 C.1 V.1 B.1 N.1 M.1 (<.1 )>.1 .,.1 100.96,13.13 100.96,26.04 96.52,30.48 96.52,35.56 93.98,38.1 91.44,38.1 78.74,50.8 67.31,50.8 59.69,58.42 v57.79,58.42
  Bottom 0.406: U3.40 54.14,55.88 56.68,58.42 v57.79,58.42
ROW1  (via drill 0.5)  (1 unrouted)
  Top 0.406: v57.79,56.52 60.33,56.52 66.67,50.17 78.1,50.17 90.8,37.47 93.34,37.47 95.25,35.56 95.25,30.48 99.69,26.04 99.69,20.95 98.42,19.68 85.29,19.68 L.1 K.1 J.1 H.1 G.1 F.1 D.1 S.1 A.1 11.99,18.49 10.79,19.68 6.98,19.68 5.71,20.95 v5.71,34.29
  Bottom 0.406: U3.41 54.94,54.94 56.52,56.52 v57.79,56.52 | v5.71,34.29 6.35,34.93 6.35,42.34 ESC.1
ROW2  (via drill 0.5)  (1 unrouted)
  Top 0.406: Q.1 W.1 E.1 R.1 T.1 Y.1 U.1 I.1 O.1 P.1 ENTER.1 93.98,28.85 93.98,35.56 92.71,36.83 90.17,36.83 77.47,49.53 66.04,49.53 60.96,54.61 v57.79,54.61
  Bottom 0.406: U3.42 55.74,53.84 56.52,54.61 v57.79,54.61
ROW3  (via drill 0.5)
  Top 0.406: 1'.1 2".1 3#.1 4=.1 5-.1 6+.1 7/.1 8*.1 9\\.1 | 9\\.1 74.93,35.28 0.1 90.17,35.28 | 90.17,35.28 DEL.1 | v57.79,52.71 61.6,52.71 65.41,48.9 76.83,48.9 90.17,35.56 90.17,35.28 | 71.48,35.28 9\\.1
  Bottom 0.406: U3.43 56.54,52.73 v57.79,52.71
RX-I  (4 unrouted)
  Bottom 0.406: U3.9 60.82,42.69 64.14,39.37 83.82,39.37 85.09,38.1 99.06,38.1 101.6,40.64 101.6,41.91 102.87,43.18 JP1.4
SCK
  Top 0.406: J2.3 91.44,44.45 90.8,43.82 90.8,40.01 92.08,38.74 97.16,38.74 101.6,34.29 101.6,33.02 102.65,31.97 D5.A
  Bottom 0.406: U3.3 62.09,47.49 64.14,49.53 78.74,49.53 85.09,43.18 90.17,43.18 91.44,44.45 J2.3
SCL  (via drill 0.5)
  Top 0.406: J1.1 48.9,59.05 50.8,57.15 v50.8,43.82
  Bottom 0.406: v50.8,43.82 51.74,42.88 U3.19
SDA  (via drill 0.5)
  Top 0.406: v49.53,41.91 49.53,57.15 48.26,58.42 17.78,58.42 15.88,56.52 J1.2
  Bottom 0.406: v49.53,41.91 50.94,40.5 U3.20
SHIFT  (1 unrouted)
  Top 0.406: SHIFTR.3 90.37,14.61 5.08,14.61 3.45,12.98 SHIFT.3
  Bottom 0.406: U3.26 45.39,43.49 41.28,39.37 26.67,39.37 24.13,36.83 8.89,36.83 7.62,35.56 7.62,33.66 6.35,32.38 1.91,32.38 1.27,31.75 1.27,14.81 SHIFT.3
SHIFTR  (via drill 0.5)
  Top 0.406: v86.36,48.26 83.19,51.44 68.58,51.44 v66.04,53.98
  Bottom 0.406: U3.44 58.51,50.89 61.6,53.98 v66.04,53.98 | SG1.1 87.78,46.84 v86.36,48.26
TX-O
  Bottom 0.406: U3.10 60.35,41.89 63.5,38.74 83.19,38.74 84.45,37.47 99.69,37.47 102.87,40.64 JP1.5

### Text on the board
tPlace: SCL | SDA | VCC | ON | GND | GND | GND | VCC | CTS | AD0 | VCC | AD1 | RX | AD2 | TX | GND | AD3 | DTR | ;
bPlace: Technoblogy | Lisp Badge